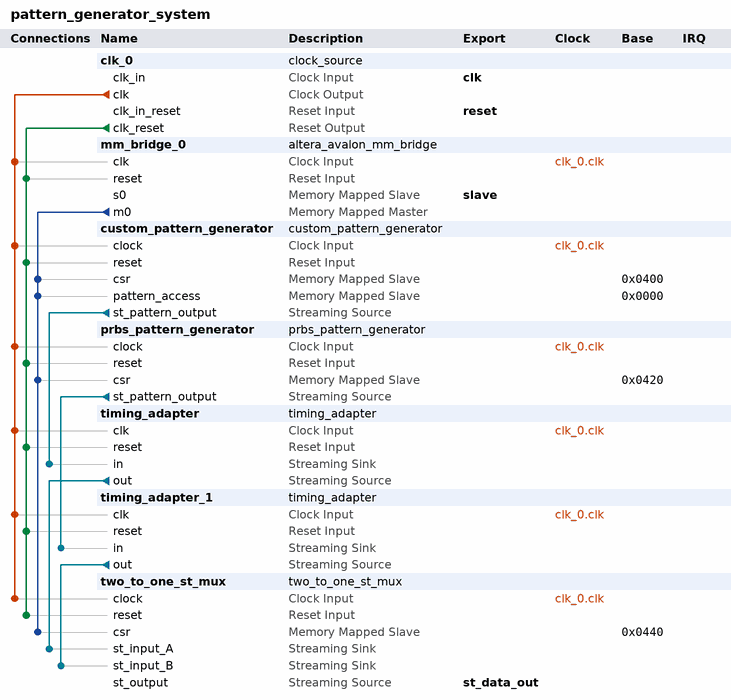
[diagram p0: system contents]
# Platform Designer (Qsys) system pattern_generator_system
# Parameters at their usual value, and those the tool derives, are not listed.
package require -exact qsys 11.0
create_system pattern_generator_system
set_project_property DEVICE_FAMILY CYCLONEIII

add_instance clk_0 clock_source 11.0
set_instance_parameter_value clk_0 clockFrequency 50000000
set_instance_parameter_value clk_0 clockFrequencyKnown false

add_instance mm_bridge_0 altera_avalon_mm_bridge 11.0
set_instance_parameter_value mm_bridge_0 DATA_WIDTH 32
set_instance_parameter_value mm_bridge_0 ADDRESS_WIDTH 11
set_instance_parameter_value mm_bridge_0 ADDRESS_UNITS SYMBOLS
set_instance_parameter_value mm_bridge_0 MAX_PENDING_RESPONSES 4

add_instance custom_pattern_generator custom_pattern_generator 1.1
set_instance_parameter_value custom_pattern_generator DATA_WIDTH 32
set_instance_parameter_value custom_pattern_generator MAX_PATTERN_LENGTH 256

add_instance prbs_pattern_generator prbs_pattern_generator 1.1
set_instance_parameter_value prbs_pattern_generator DATA_WIDTH 32

add_instance timing_adapter timing_adapter 11.0
set_instance_parameter_value timing_adapter inBitsPerSymbol 8
set_instance_parameter_value timing_adapter inChannelWidth 0
set_instance_parameter_value timing_adapter inErrorWidth 0
set_instance_parameter_value timing_adapter inMaxChannel 0
set_instance_parameter_value timing_adapter inReadyLatency 3
set_instance_parameter_value timing_adapter inSymbolsPerBeat 4
set_instance_parameter_value timing_adapter inUseEmptyPort NO
set_instance_parameter_value timing_adapter inUsePackets false
set_instance_parameter_value timing_adapter inUseReady true
set_instance_parameter_value timing_adapter inUseValid true
set_instance_parameter_value timing_adapter outReadyLatency 0
set_instance_parameter_value timing_adapter outUseReady true
set_instance_parameter_value timing_adapter outUseValid true

add_instance timing_adapter_1 timing_adapter 11.0
set_instance_parameter_value timing_adapter_1 inBitsPerSymbol 8
set_instance_parameter_value timing_adapter_1 inChannelWidth 0
set_instance_parameter_value timing_adapter_1 inErrorWidth 0
set_instance_parameter_value timing_adapter_1 inMaxChannel 0
set_instance_parameter_value timing_adapter_1 inReadyLatency 1
set_instance_parameter_value timing_adapter_1 inSymbolsPerBeat 4
set_instance_parameter_value timing_adapter_1 inUseEmptyPort NO
set_instance_parameter_value timing_adapter_1 inUsePackets false
set_instance_parameter_value timing_adapter_1 inUseReady true
set_instance_parameter_value timing_adapter_1 inUseValid true
set_instance_parameter_value timing_adapter_1 outReadyLatency 0
set_instance_parameter_value timing_adapter_1 outUseReady true
set_instance_parameter_value timing_adapter_1 outUseValid true

add_instance two_to_one_st_mux two_to_one_st_mux 1.1
set_instance_parameter_value two_to_one_st_mux DATA_WIDTH 32

# connections
add_connection clk_0.clk custom_pattern_generator.clock clock
add_connection clk_0.clk mm_bridge_0.clk clock
add_connection clk_0.clk prbs_pattern_generator.clock clock
add_connection clk_0.clk timing_adapter.clk clock
add_connection clk_0.clk timing_adapter_1.clk clock
add_connection clk_0.clk two_to_one_st_mux.clock clock
add_connection clk_0.clk_reset custom_pattern_generator.reset reset
add_connection clk_0.clk_reset mm_bridge_0.reset reset
add_connection clk_0.clk_reset prbs_pattern_generator.reset reset
add_connection clk_0.clk_reset timing_adapter.reset reset
add_connection clk_0.clk_reset timing_adapter_1.reset reset
add_connection clk_0.clk_reset two_to_one_st_mux.reset reset
add_connection mm_bridge_0.m0 custom_pattern_generator.csr avalon
set_connection_parameter_value mm_bridge_0.m0/custom_pattern_generator.csr baseAddress 0x0400
add_connection mm_bridge_0.m0 custom_pattern_generator.pattern_access avalon
set_connection_parameter_value mm_bridge_0.m0/custom_pattern_generator.pattern_access baseAddress 0x0000
add_connection mm_bridge_0.m0 prbs_pattern_generator.csr avalon
set_connection_parameter_value mm_bridge_0.m0/prbs_pattern_generator.csr baseAddress 0x0420
add_connection mm_bridge_0.m0 two_to_one_st_mux.csr avalon
set_connection_parameter_value mm_bridge_0.m0/two_to_one_st_mux.csr baseAddress 0x0440
add_connection custom_pattern_generator.st_pattern_output timing_adapter.in avalon_streaming
add_connection prbs_pattern_generator.st_pattern_output timing_adapter_1.in avalon_streaming
add_connection timing_adapter.out two_to_one_st_mux.st_input_A avalon_streaming
add_connection timing_adapter_1.out two_to_one_st_mux.st_input_B avalon_streaming

# exported interfaces
add_interface clk clock sink
set_interface_property clk EXPORT_OF clk_0.clk_in
add_interface reset reset sink
set_interface_property reset EXPORT_OF clk_0.clk_in_reset
add_interface slave avalon slave
set_interface_property slave EXPORT_OF mm_bridge_0.s0
add_interface st_data_out avalon_streaming source
set_interface_property st_data_out EXPORT_OF two_to_one_st_mux.st_output

save_system pattern_generator_system.qsys
